# EAGLE design romcart_8k (EAGLE 9.6.2)
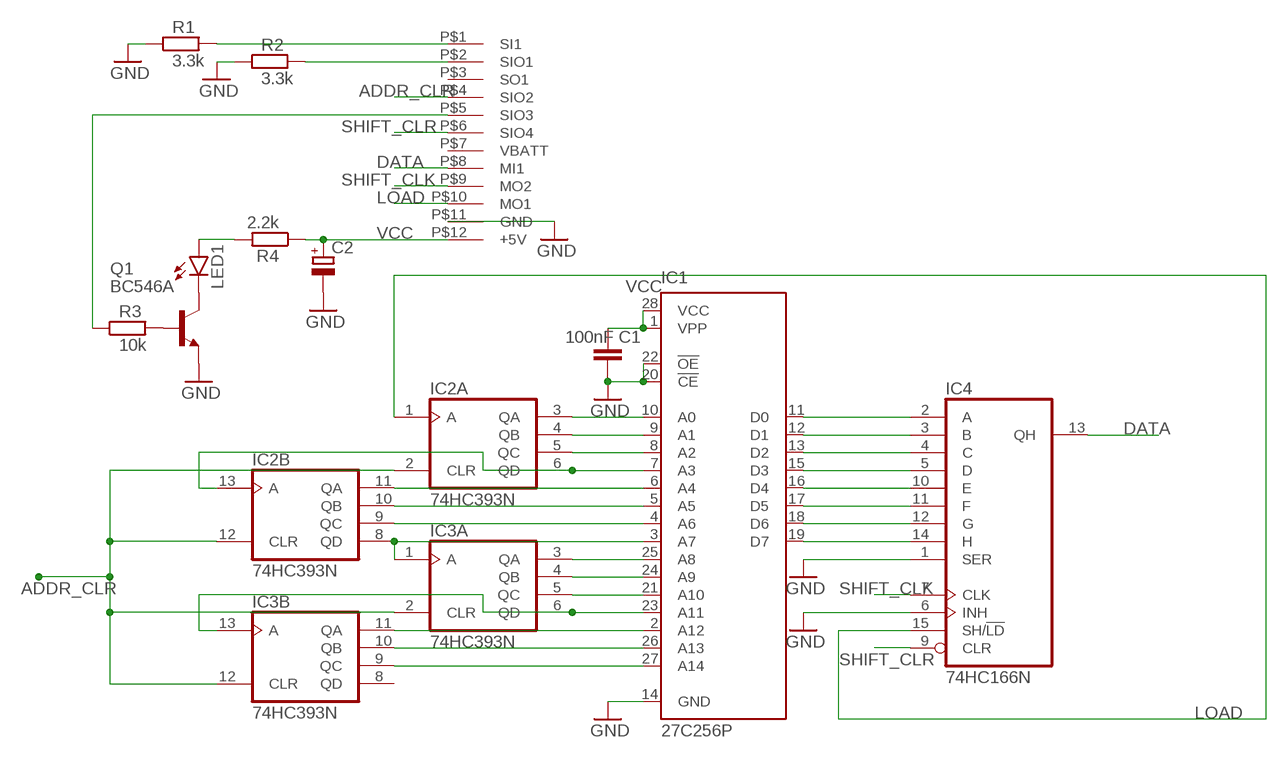
[diagram p0: schematic, sheet 1]

## Parts
C1  100nF  C2,5-3  [C2.5-3]
C2  CPOL-EUE3.5-8  [E3,5-8]
IC1  27C256P  [DIL28-6]
IC2  74HC393N  [DIL14]
IC3  74HC393N  [DIL14]
IC4  74HC166N  [DIL16]
LED1  LED3MM  [LED3MM]
Q1  BC546A  [TO92-EBC]
R1  3.3k  R-EU_0204/5  [0204/5]
R2  3.3k  R-EU_0204/5  [0204/5]
R3  10k  R-EU_0204/5  [0204/5]
R4  2.2k  R-EU_0204/5  [0204/5]
U$1  HX20_CASSETTE  [HX20_CASSETTE]

## Nets
ADDR_CLR: IC2.2(A:CLR) IC2.12(B:CLR) IC3.2(A:CLR) IC3.12(B:CLR) U$1.P$4(SIO2)
DATA: IC4.13(QH) U$1.P$8(MI1)
GND: C1.2 C2.- IC1.14(GND) IC1.20(!CE) IC1.22(!OE) IC4.1(SER) IC4.6(INH) Q1.E R1.1 R2.1 U$1.P$11(GND)
LOAD: IC2.1(A:A) IC4.15(SH/!LD) U$1.P$10(MO1)
N$1: IC1.10(A0) IC2.3(A:QA)
N$2: IC1.9(A1) IC2.4(A:QB)
N$3: IC1.8(A2) IC2.5(A:QC)
N$4: IC1.7(A3) IC2.6(A:QD) IC2.13(B:A)
N$5: IC1.6(A4) IC2.11(B:QA)
N$6: IC1.5(A5) IC2.10(B:QB)
N$7: IC1.4(A6) IC2.9(B:QC)
N$8: IC1.3(A7) IC2.8(B:QD) IC3.1(A:A)
N$9: IC1.25(A8) IC3.3(A:QA)
N$10: IC1.24(A9) IC3.4(A:QB)
N$11: IC1.21(A10) IC3.5(A:QC)
N$12: IC1.23(A11) IC3.6(A:QD) IC3.13(B:A)
N$13: IC1.2(A12) IC3.11(B:QA)
N$14: IC1.26(A13) IC3.10(B:QB)
N$15: IC1.27(A14) IC3.9(B:QC)
N$16: IC1.11(D0) IC4.2(A)
N$17: IC1.12(D1) IC4.3(B)
N$18: IC1.13(D2) IC4.4(C)
N$19: IC1.15(D3) IC4.5(D)
N$20: IC1.16(D4) IC4.10(E)
N$21: IC1.17(D5) IC4.11(F)
N$22: IC1.18(D6) IC4.12(G)
N$23: IC1.19(D7) IC4.14(H)
N$24: Q1.B R3.2
N$25: R1.2 U$1.P$1(SI1)
N$26: R2.2 U$1.P$2(SIO1)
N$27: LED1.K(C) Q1.C
N$28: LED1.A R4.2
N$30: R3.1 U$1.P$5(SIO3)
SHIFT_CLK: IC4.7(CLK) U$1.P$9(MO2)
SHIFT_CLR: IC4.9(CLR) U$1.P$6(SIO4)
VCC: C1.1 C2.+ IC1.1(VPP) IC1.28(VCC) R4.1 U$1.P$12(+5V)
Unconnected: IC3.8(B:QD) U$1.P$3(SO1) U$1.P$7(VBATT)

## Power pins joined to a net without a drawn wire
GND: IC2.7(P:GND) IC3.7(P:GND) IC4.8(GND)
VCC: IC2.14(P:VCC) IC3.14(P:VCC) IC4.16(VCC)

## Library data of the parts
C1 = capacitor-wima:C: CAPACITOR naming: grid - package width
C2 = rcl:CPOL-EU: POLARIZED CAPACITOR, European symbol; SPICEPREFIX: C
IC1 = microchip:27*256: CMOS EPROM 256 K (32 K x 8), low voltage; MF: Arrow Electronics; MPN: M27C256B15F1; OC_FARNELL: 1125431; OC_NEWARK: 93K7335
IC2 IC3 = 74xx-eu:74*393: Dual 4-bit decade and binary COUNTER
IC4 = 74xx-eu:74*166: 8-bit parallel load SHIFT REGISTER
LED1 = led:LED: LED OSRAM: - CHIPLED LG R971, LG N971, LY N971, LG Q971, LY Q971, LO R971, LY R971 LH N974, LH R974 LS Q976, LO Q976, LY Q976 LO Q996 - Hyper CHIPLED LW Q18S LB Q993, LB Q99A, LB R99A - SideLED LS A670, LO A670, LY A670, LG A670, LP A670 LB A673, LV A673, LT A673, LW A673 LH A674 LY A675 LS A676, LA A676, LO A676, LY A676, LW A676 LS A679, LY A679, LG A679 - Hyper Micro SIDELED® LS Y876, LA Y876, LO Y876, LY Y876 LT Y87S - SmartLED LW L88C, LW L88S LB L89C, LB L89S, LG L890 LS L89K, LO L89K, LY L89K LS L896, LA L896, LO L896, LY L896 - TOPLED LS T670, LO T670, LY T670, LG T670, LP T670 LSG T670, LSP T670, LSY T670, LOP T670, LYG T670 LG T671, LOG T671, LSG T671 LB T673, LV T673, LT T673, LW T673 LH T674 LS T676, LA T676, LO T676, LY T676, LB T676, LH T676, LSB T676, LW T676 LB T67C, LV T67C, LT T67C, LS T67K, LO T67K, LY T67K, LW E67C LS E67B, LA E67B, LO E67B, LY E67B, LB E67C, LV E67C, LT E67C LW T67C LS T679, LY T679, LG T679 LS T770, LO T770, LY T770, LG T770, LP T770 LB T773, LV T773, LT T773, LW T773 LH T774 LS E675, LA E675, LY E675, LS T675 LS T776, LA T776, LO T776, LY T776, LB T776 LHGB T686 LT T68C, LB T68C - Hyper Mini TOPLED® LB M676 - Mini TOPLED Santana® LG M470 LS M47K, LO M47K, LY M47K Source: http://www.osram.convergy.de LUXEON: - LUMILED® LXK2-PW12-R00, LXK2-PW12-S00, LXK2-PW14-U00, LXK2-PW14-V00 LXK2-PM12-R00, LXK2-PM12-S00, LXK2-PM14-U00 LXK2-PE12-Q00, LXK2-PE12-R00, LXK2-PE12-S00, LXK2-PE14-T00, LXK2-PE14-U00 LXK2-PB12-K00, LXK2-PB12-L00, LXK2-PB12-M00, LXK2-PB14-N00, LXK2-PB14-P00, LXK2-PB14-Q00 LXK2-PR12-L00, LXK2-PR12-M00, LXK2-PR14-Q00, LXK2-PR14-R00 LXK2-PD12-Q00, LXK2-PD12-R00, LXK2-PD12-S00 LXK2-PH12-R00, LXK2-PH12-S00 LXK2-PL12-P00, LXK2-PL12-Q00, LXK2-PL12-R00 Source: www.luxeon.com KINGBRIGHT: KA-3528ASYC Source: www.kingbright.com
Q1 = transistor-npn:BC546*: NPN Transistor
R1-R4 = rcl:R-EU_: RESISTOR, European symbol; SPICEPREFIX: R
U$1 = hx20:HX20_CASSETTE

## Board
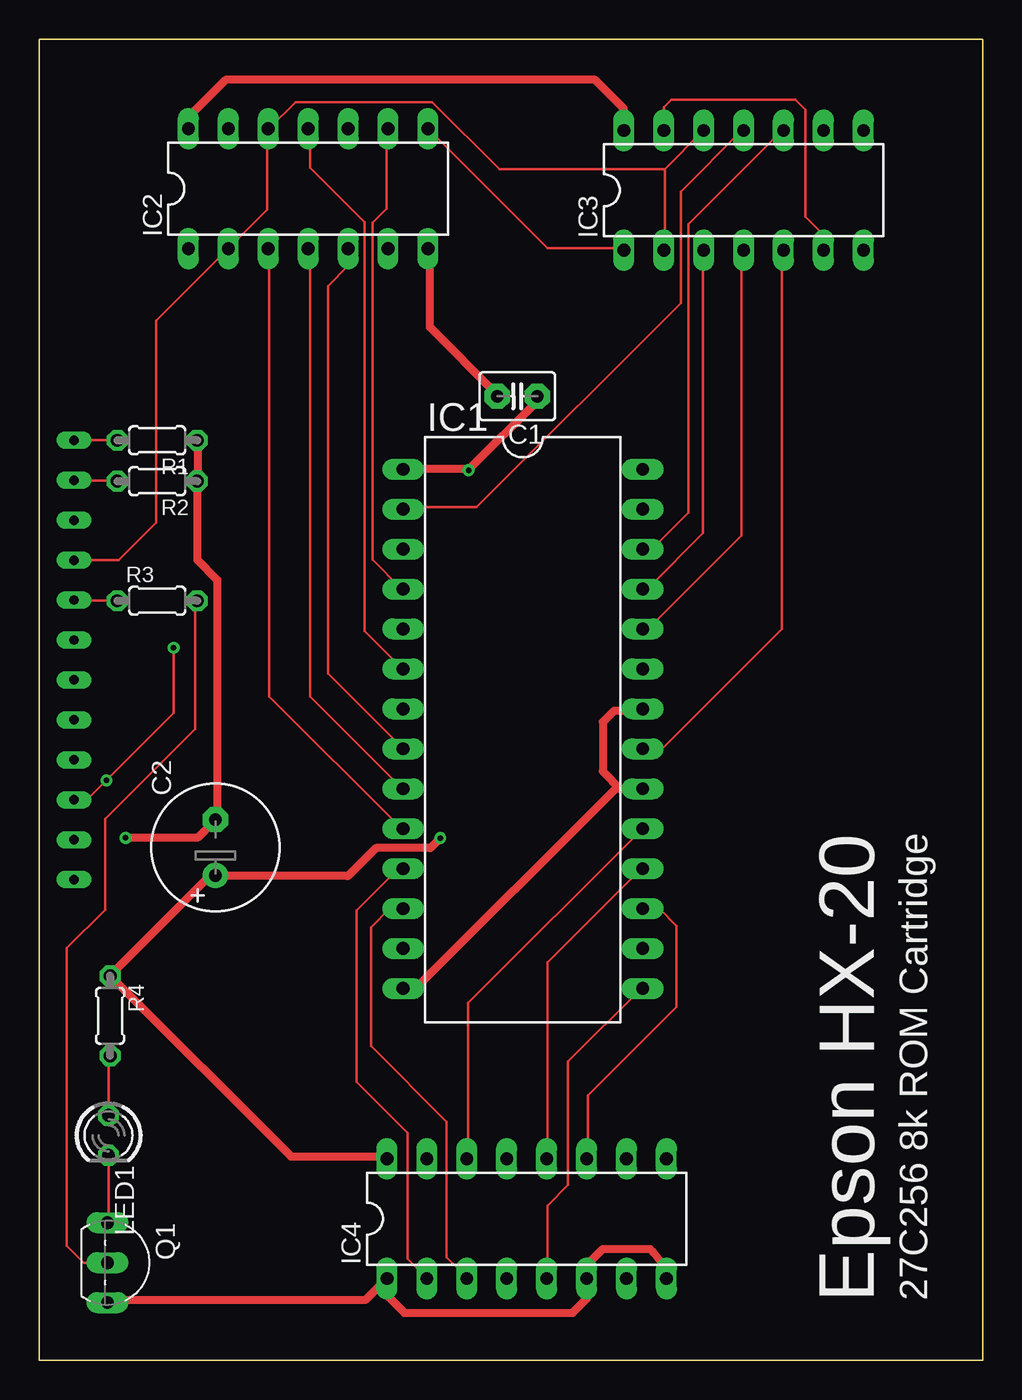
[diagram p1: board, top side]
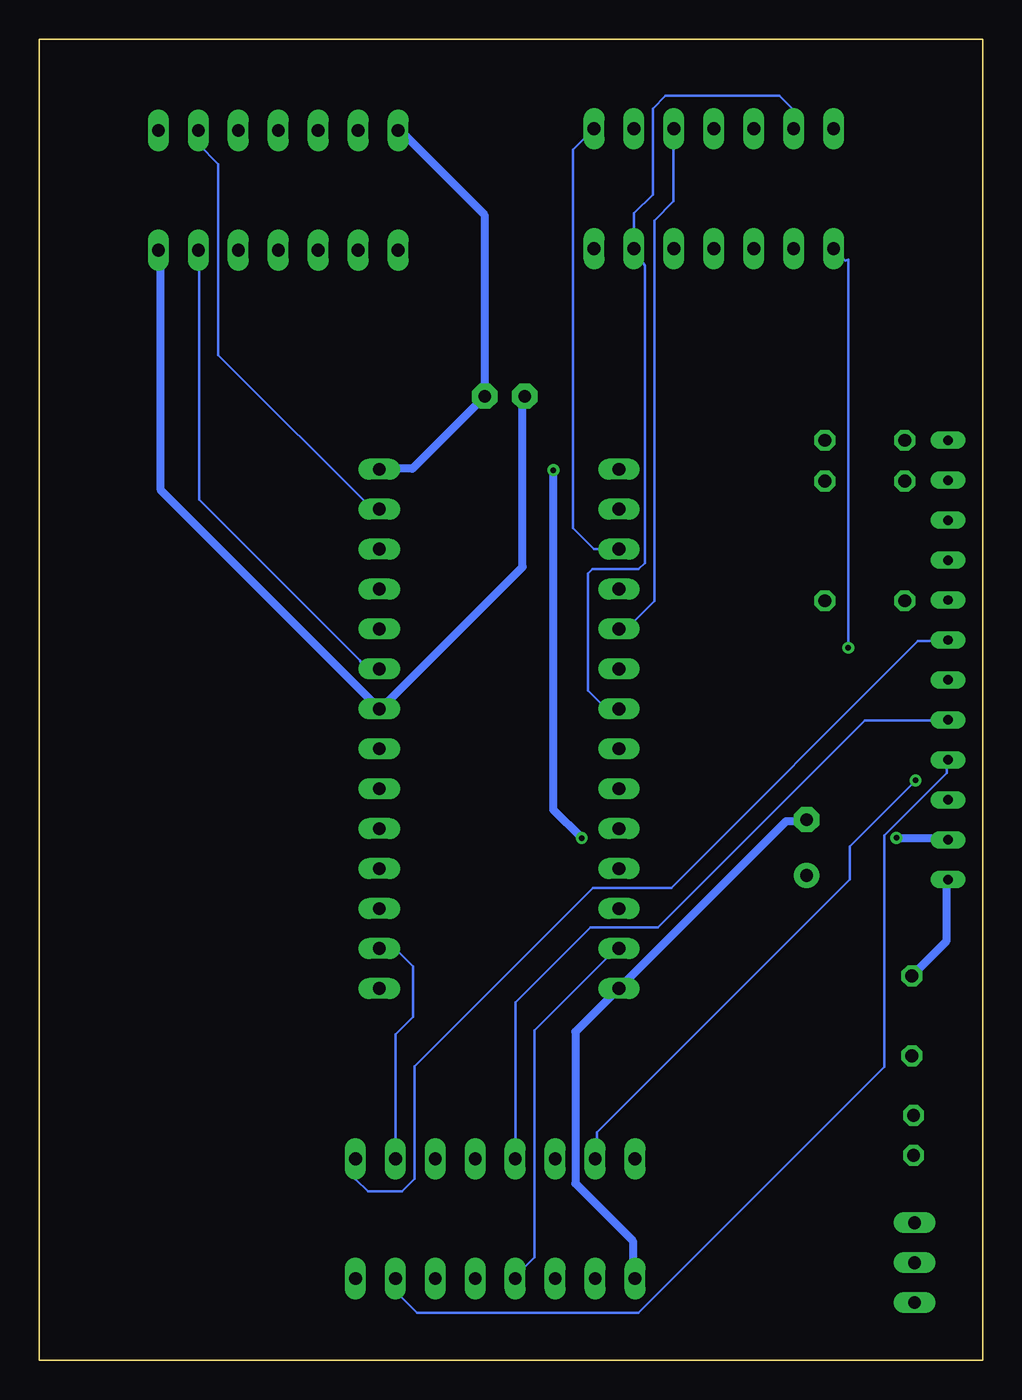
[diagram p2: board, bottom side, seen from below]

Size 60 x 84 mm. Coordinates in mm from the lower left corner, seen from the top.
Outline: 60,84 60,0 0,0 0,84 60,84
Copper layers (1*16): Top 0.035mm / dielectric 1.5mm / Bottom 0.035mm
Design rules "default": minimum track width 6mil, minimum drill 0.35mm, track to track 6mil, track to pad 6mil, pad to pad 6mil, via to via 6mil, smd to smd 6mil, copper to edge 40mil, drill to drill 6mil, minimum pad ring 10mil, minimum via ring 8mil, stop-mask expansion 4mil, vias tented up to drill 0mil, thermal gap 10mil

### Footprints (pad centres in the part's own frame; a part is rotated, then mirrored left to right if it is on the bottom)
C2.5-3 = drill 0.813 pad 1.6 octagon: 1 -1.27,0; 2 1.27,0
E3,5-8 = drill 0.813 pad 1.6: + -1.778,0 | drill 0.813 pad 1.6 octagon: - 1.778,0
DIL28-6 = drill 0.813 long: 1 -16.51,-7.62; 2 -13.97,-7.62; 3 -11.43,-7.62; 4 -8.89,-7.62; 5 -6.35,-7.62; 6 -3.81,-7.62; 7 -1.27,-7.62; 8 1.27,-7.62; 9 3.81,-7.62; 10 6.35,-7.62; 11 8.89,-7.62; 12 11.43,-7.62; 13 13.97,-7.62; 14 16.51,-7.62; 15 16.51,7.62; 16 13.97,7.62; 17 11.43,7.62; 18 8.89,7.62; 19 6.35,7.62; 20 3.81,7.62; 21 1.27,7.62; 22 -1.27,7.62; 23 -3.81,7.62; 24 -6.35,7.62; 25 -8.89,7.62; 26 -11.43,7.62; 27 -13.97,7.62; 28 -16.51,7.62
DIL14 = drill 0.813 long: 1 -7.62,-3.81; 2 -5.08,-3.81; 3 -2.54,-3.81; 4 0,-3.81; 5 2.54,-3.81; 6 5.08,-3.81; 7 7.62,-3.81; 8 7.62,3.81; 9 5.08,3.81; 10 2.54,3.81; 11 0,3.81; 12 -2.54,3.81; 13 -5.08,3.81; 14 -7.62,3.81
DIL16 = drill 0.813 long: 1 -8.89,-3.81; 2 -6.35,-3.81; 3 -3.81,-3.81; 4 -1.27,-3.81; 5 1.27,-3.81; 6 3.81,-3.81; 7 6.35,-3.81; 8 8.89,-3.81; 9 8.89,3.81; 10 6.35,3.81; 11 3.81,3.81; 12 1.27,3.81; 13 -1.27,3.81; 14 -3.81,3.81; 15 -6.35,3.81; 16 -8.89,3.81
LED3MM = drill 0.813 octagon: A -1.27,0; K 1.27,0
TO92-EBC = drill 0.813 long: B 0,-1.27; C -2.54,-1.27; E 2.54,-1.27
0204/5 = drill 0.813 octagon: 1 -2.54,0; 2 2.54,0
HX20_CASSETTE = drill 0.6 long: P$1 0,12.7; P$2 0,10.16; P$3 0,7.62; P$4 0,5.08; P$5 0,2.54; P$6 0,0; P$7 0,-2.54; P$8 0,-5.08; P$9 0,-7.62; P$10 0,-10.16; P$11 0,-12.7; P$12 0,-15.24

### Placement (x,y rotation side)
C1  30.4,61.3 180 top
C2  11.2,32.6 90 top
IC1  30.75,40.15 270 top
IC2  17.1,74.5 0 top
IC3  44.8,74.4 0 top
IC4  31,9 0 top
LED1  4.4,14.3 270 top
Q1  5.6,6.2 270 top
R1  7.5,58.5 180 top
R2  7.5,55.9 180 top
R3  7.5,48.3 0 top
R4  4.5,21.9 270 top
U$1  2.2,45.8 0 top

### Tracks (layer width: path | path; a pad name or v marks a point on that pad's centre or on a via)
ADDR_CLR
  Top 0.152: 39.78,75.74 39.78,70.71 IC3.2 | 39.78,75.74 42.22,78.18 IC3.12 | U$1.P$4 5.05,50.88 7.44,53.27 7.44,66.12 11.89,70.56 IC2.2 12.04,70.71 14.48,73.15 14.48,78.18 IC2.12 14.63,78.33 16.31,80.01 24.99,80.01 29.26,75.74 39.78,75.74
DATA
  Bottom 0.152: U$1.P$8 2.29,40.69 7.49,40.69 20.65,27.53 24.93,27.53 29.72,22.74 29.72,12.95 IC4.13
GND  (via drill 0.35)
  Top 0.152: 24.84,70.56 IC2.7 | 29.11,61.42 C1.2 | 38.25,41.3 IC1.22 | 4.42,3.81 Q1.E | 22.1,5.18 IC4.1 | 10.06,55.93 R2.1 10.06,55.78 | 10.06,58.37 R1.1 | 23.3,23.64 IC1.14 | 11.12,34.29 C2.-
  Top 0.508: 24.84,70.56 24.84,65.68 29.11,61.42 | IC1.20 37.7,36.34 36.95,36.34 | 36.95,36.34 36.63,36.34 23.8,23.51 23.3,23.64 | 38.25,41.3 36.55,41.3 35.84,40.59 35.84,37.45 36.95,36.34 | IC4.8 39.89,5.8 39.05,6.86 38.85,7.06 35.83,7.06 34.81,6.04 IC4.6 34.81,3.9 33.91,3 23.23,3 22.11,4.12 IC4.1 | 4.42,3.81 20.73,3.81 22.1,5.18 | 10.06,58.37 10.06,55.93 | 10.06,55.78 10.06,50.88 11.32,49.62 11.32,34.5 C2.- | v5.49,33.22 10.06,33.22 11.12,34.29
  Bottom 0.152: 52.27,70.56 IC3.7 | 38.41,41.45 IC1.22 38.25,41.45 | 29.26,61.27 C1.2 | 2.29,33.22 U$1.P$11 | 22.25,5.33 IC4.1 | 23.16,23.62 IC1.14 23.01,23.77 | 11.28,34.29 C2.-
  Bottom 0.508: 52.27,70.56 52.27,55.32 38.41,41.45 | 29.26,61.27 29.26,50.44 38.25,41.45 | v5.49,33.22 2.29,33.22 | 22.25,5.33 22.25,7.58 25.9,11.23 25.9,20.88 23.16,23.62 | 11.28,34.29 12.5,34.29 23.01,23.77
LOAD  (via drill 0.35)
  Top 0.152: U$1.P$10 2.29,35.66 3.06,35.66 v4.27,36.87 8.54,41.15 v8.54,45.3
  Bottom 0.152: v4.27,36.87 8.45,32.69 8.45,30.56 24.54,14.48 24.54,12.95 IC4.15 | v8.54,45.3 8.54,69.97 8.72,69.93 IC2.1
N$1
  Top 0.152: IC2.3 14.63,70.56 14.63,42.22 23.01,33.83 IC1.10
N$2
  Top 0.152: IC2.4 17.22,70.56 17.22,42.22 23.01,36.42 IC1.9
N$3
  Top 0.152: IC2.5 19.64,69.59 18.36,68.31 18.36,43.67 23.01,39.01 IC1.8
N$4
  Bottom 0.152: IC2.13 12.02,79.5 12.93,80.41 20.16,80.41 20.98,79.59 20.98,74.13 22.18,72.93 IC2.6 21.49,69.6 21.49,50.71 21.9,50.3 24.82,50.3 25.09,50.03 25.09,42.59 23.92,41.42 IC1.7
N$5
  Top 0.152: IC2.11 17.22,78.18 17.22,75.83 20.68,72.38 20.68,46.38 23.01,44.04 IC1.6
N$6
  Bottom 0.152: IC1.5 22.65,46.5 20.88,48.26 20.88,72.47 19.66,73.69 19.66,78.18 IC2.10
N$7
  Top 0.152: IC2.9 22.1,78.18 22.1,73.24 21.18,72.33 21.18,50.9 23.01,49.07 IC1.4
N$8
  Top 0.152: IC3.1 37.03,70.71 32.31,70.71 24.84,78.18 IC2.8
  Bottom 0.152: IC1.3 24.72,51.58 26.06,52.91 26.06,76.97 24.84,78.18 IC2.8
N$9
  Top 0.152: IC1.25 38.8,49.45 38.8,49.18 42.22,52.59 42.22,70.56 IC3.3
N$10
  Top 0.152: IC1.24 38.71,46.5 44.65,52.44 44.65,70.56 IC3.4
N$11
  Top 0.152: IC1.21 39.61,38.88 47.24,46.51 47.24,70.56 IC3.5
N$12
  Top 0.152: IC3.13 39.72,79.67 40.21,80.16 48.1,80.16 48.72,79.54 48.72,72.73 49.88,71.57 IC3.6
  Bottom 0.152: IC1.23 39.37,43.96 39.59,44.48 49.84,54.73 49.84,70.56 IC3.6
N$13
  Top 0.152: IC1.2 23.16,54.25 27.81,54.25 40.8,67.24 40.8,74.32 44.65,78.18 IC3.11
N$14
  Top 0.152: IC1.26 38.96,51.58 41.3,53.92 41.3,72.24 47.24,78.18 IC3.10
N$15
  Bottom 0.152: IC3.9 49.88,77.33 48.62,76.07 48.62,63.93 38.41,53.71 38.41,54.24 IC1.27
N$16
  Top 0.152: IC1.11 22.84,31.26 20.18,28.6 20.18,17.7 23.42,14.46 23.42,6.45 24.54,5.33 IC4.2
N$17
  Top 0.152: IC1.12 22.29,28.72 21.09,27.52 21.09,19.98 25.91,15.16 25.91,6.55 27.13,5.33 IC4.3
N$18
  Bottom 0.152: IC1.13 23.29,26.18 28.5,20.96 28.5,6.55 29.72,5.33 IC4.4
N$19
  Top 0.152: IC4.5 32.31,5.33 32.31,9.82 33.63,11.14 33.63,19 38.25,23.62 IC1.15
N$20
  Bottom 0.152: IC4.10 37.34,12.95 37.34,20.71 36.23,21.82 36.23,25.04 37.25,26.06 38.25,26.06 IC1.16
N$21
  Top 0.152: IC1.17 39.44,28.72 40.53,27.63 40.53,22.46 34.9,16.84 34.9,12.95 IC4.11
N$22
  Top 0.152: IC4.12 32.31,12.95 32.31,25.3 38.25,31.24 IC1.18
N$23
  Top 0.152: IC4.14 27.28,12.95 27.28,22.71 38.25,33.68 IC1.19
N$24
  Top 0.152: Q1.B 2.83,6.2 1.74,7.28 1.74,26.21 4.18,28.65 4.18,34.42 9.91,40.15 9.91,48.16 R3.2
N$25
  Top 0.152: U$1.P$1 2.29,58.52 4.88,58.52 R1.2
N$26
  Top 0.152: U$1.P$2 2.29,55.93 4.88,55.93 R2.2
N$27
  Top 0.152: Q1.C 4.42,8.84 4.42,12.95 LED1.K
N$28
  Top 0.152: LED1.A 4.42,15.7 4.42,19.36 R4.2
N$30
  Top 0.152: U$1.P$5 2.29,48.31 4.88,48.31 R3.1
SHIFT_CLK
  Bottom 0.152: IC4.7 37.35,4.39 35.96,3 21.89,3 6.25,18.65 6.25,33.38 2.29,37.34 2.29,38.1 U$1.P$9
SHIFT_CLR
  Bottom 0.152: IC4.9 39.89,11.52 39.1,10.72 36.93,10.72 36.12,11.54 36.12,18.69 24.78,30.03 19.8,30.03 4.12,45.72 2.29,45.72 U$1.P$6
VCC  (via drill 0.35)
  Top 0.152: 22.1,12.95 IC4.16 | 4.57,24.38 R4.1 4.57,24.54 | C1.1 31.67,60.99 | 19.61,30.77 19.6,30.79 | 11.28,30.79 C2.+ 11.12,30.79 10.82,30.79
  Top 0.508: 22.1,12.95 16,12.95 4.57,24.38 | 27.38,56.69 31.67,60.99 | IC3.14 37.18,79.59 35.35,81.42 11.84,81.42 9.48,79.06 IC2.14 | 19.61,30.77 21.41,32.57 24.88,32.57 25.5,33.19 v25.5,33.2 | 19.6,30.79 11.28,30.79 | 4.57,24.54 10.82,30.79 | 27.38,56.69 27.37,56.7 | IC1.1 27.24,56.66 v27.3,56.6 27.3,56.62 27.38,56.69
  Bottom 0.152: 4.42,24.54 R4.1 | 38.25,56.69 IC1.28 | 31.7,61.27 C1.1 31.7,61.42 | 37.03,78.18 IC3.14
  Bottom 0.508: 4.42,24.54 2.29,26.67 2.29,30.48 U$1.P$12 | 38.25,56.69 36.27,56.69 31.7,61.27 | 31.7,61.42 31.7,72.85 37.03,78.18 | v25.5,33.2 27.3,35 v27.3,56.6

### Text on the board
tPlace: Epson HX-20 | 27C256 8k ROM Cartridge